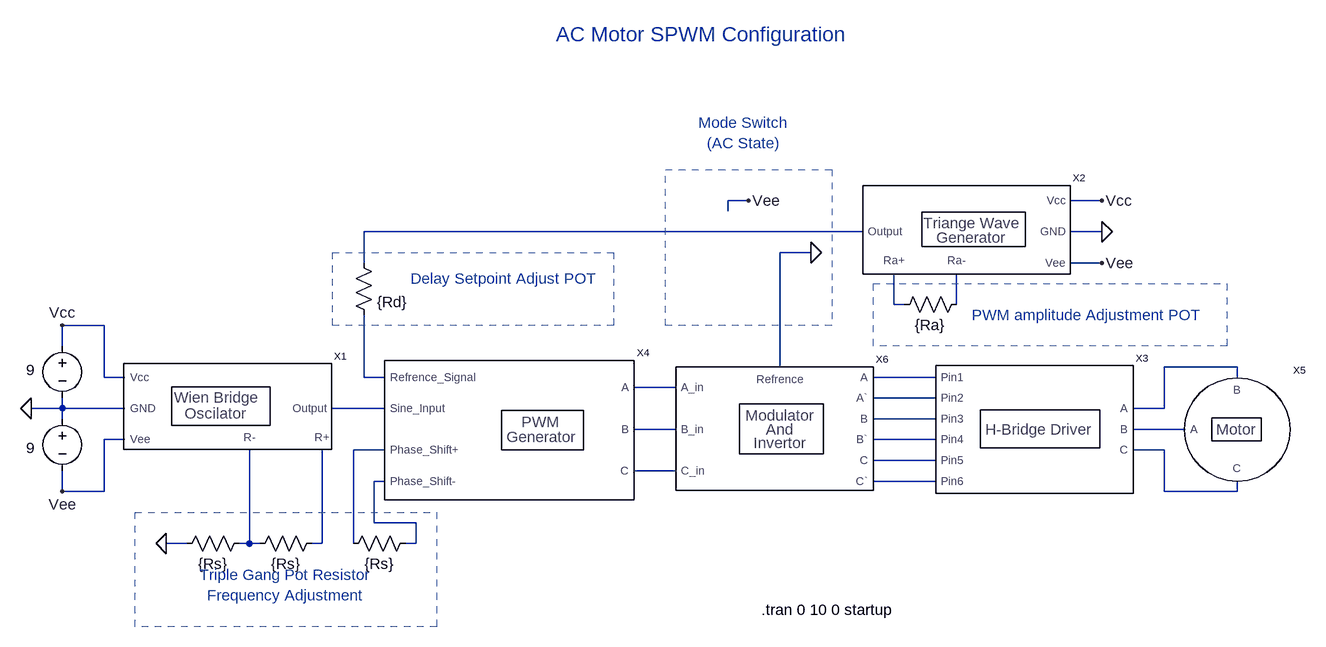
[diagram p0: schematic Complete_Design_Block_Diagram(AC).asc]
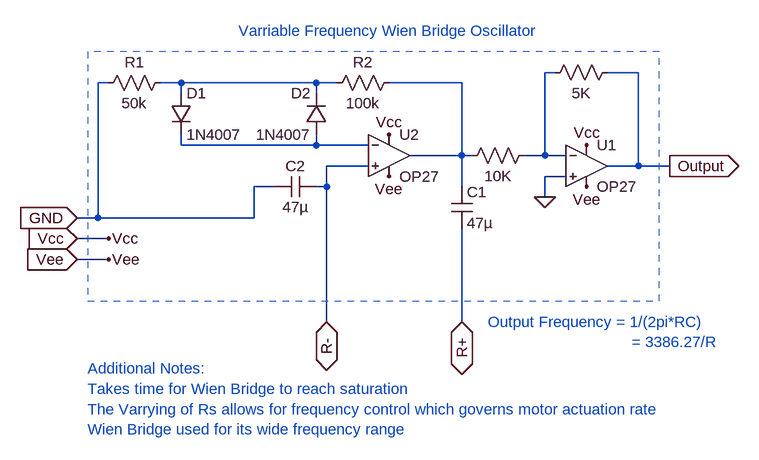
[diagram p1: sub-circuit wien_bridge_oscilator.asc]
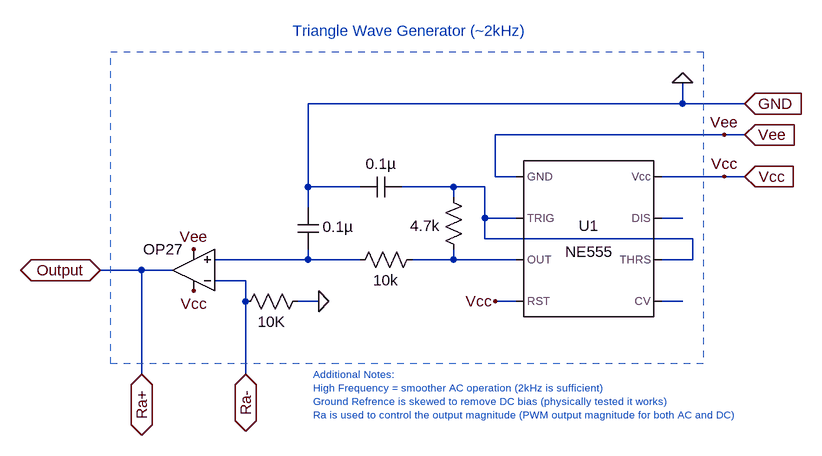
[diagram p2: sub-circuit triangle_wave_generator.asc]
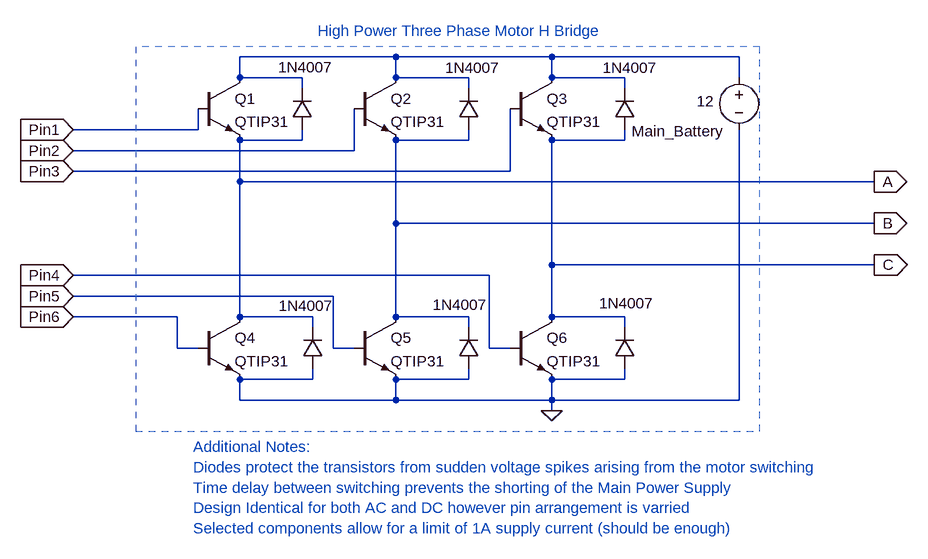
[diagram p3: sub-circuit h_bridge_driver.asc]
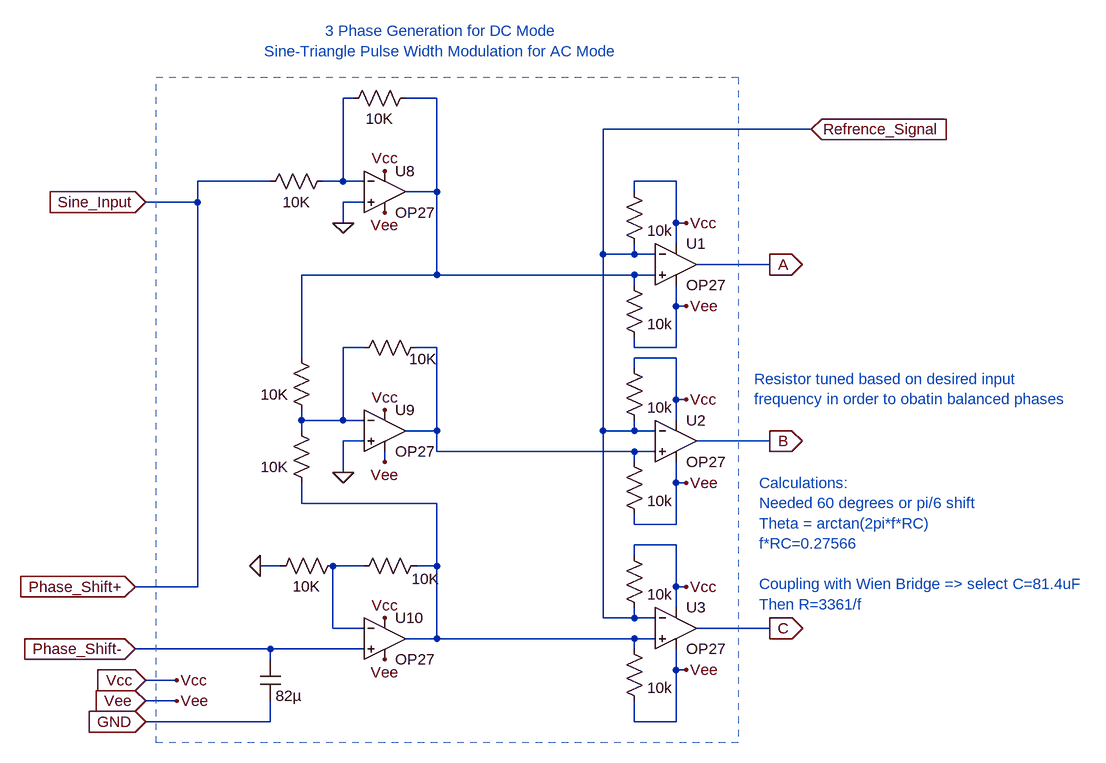
[diagram p4: sub-circuit pwm_generator.asc]
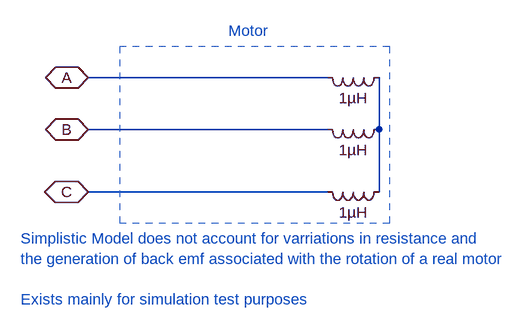
[diagram p5: sub-circuit simple_motor.asc]
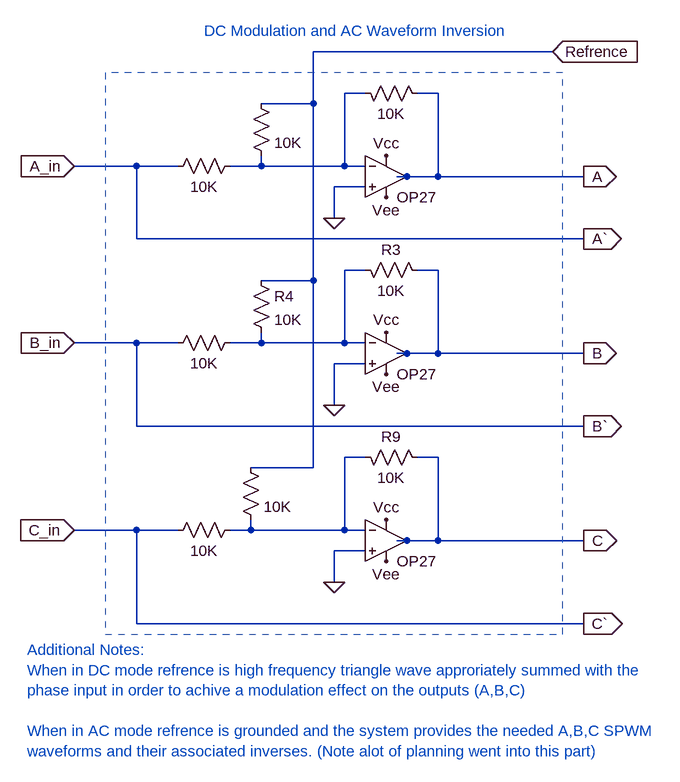
[diagram p6: sub-circuit modulation_and_inversion.asc]
Complete_Design_Block_Diagram(AC).asc, the LTspice schematic file:
Version 4
SHEET 1 1172 800
WIRE 336 32 304 32
WIRE 880 32 832 32
WIRE 304 48 304 32
WIRE 512 80 -256 80
WIRE 880 80 832 80
WIRE 432 112 384 112
WIRE -256 128 -256 80
WIRE 880 128 832 128
WIRE 560 192 560 144
WIRE 576 192 560 192
WIRE 656 192 656 144
WIRE -656 224 -720 224
WIRE -720 256 -720 224
WIRE 384 288 384 112
WIRE 1088 288 976 288
WIRE -656 304 -656 224
WIRE -624 304 -656 304
WIRE -256 304 -256 208
WIRE -224 304 -256 304
WIRE 624 304 528 304
WIRE 1088 304 1088 288
WIRE 224 320 160 320
WIRE 624 336 528 336
WIRE -720 352 -720 336
WIRE -720 352 -768 352
WIRE -624 352 -720 352
WIRE -224 352 -304 352
WIRE 976 352 976 288
WIRE 976 352 928 352
WIRE -720 368 -720 352
WIRE 624 368 528 368
WIRE 224 384 160 384
WIRE 1008 384 928 384
WIRE -624 400 -656 400
WIRE 624 400 528 400
WIRE -224 416 -272 416
WIRE 976 416 928 416
WIRE 624 432 528 432
WIRE 224 448 160 448
WIRE -224 464 -240 464
WIRE 624 464 528 464
WIRE -720 480 -720 448
WIRE -656 480 -656 400
WIRE -656 480 -720 480
WIRE 976 480 976 416
WIRE 1088 480 1088 464
WIRE 1088 480 976 480
WIRE -240 528 -240 464
WIRE -176 528 -240 528
WIRE -528 560 -560 560
WIRE -432 560 -432 416
WIRE -432 560 -448 560
WIRE -416 560 -432 560
WIRE -320 560 -320 416
WIRE -320 560 -336 560
WIRE -272 560 -272 416
WIRE -176 560 -176 528
WIRE -176 560 -192 560
FLAG -768 352 0
FLAG -720 224 Vcc
FLAG -720 480 Vee
FLAG 880 32 Vcc
FLAG 880 128 Vee
FLAG 880 80 0
FLAG -560 560 0
FLAG 432 112 0
FLAG 336 32 Vee
SYMBOL Wien_Bridge_Oscilator -480 352 R0
SYMATTR InstName X1
SYMBOL Triangle_Wave_Generator 672 80 R0
SYMATTR InstName X2
SYMBOL H_Bridge_Driver 784 384 R0
SYMATTR InstName X3
SYMBOL PWM_Generator 0 384 R0
SYMATTR InstName X4
SYMBOL Simple_Motor 1088 384 R0
SYMATTR InstName X5
SYMBOL Modulation_and_Inversion 384 384 R0
SYMATTR InstName X6
SYMBOL voltage -720 240 R0
WINDOW 0 24 16 Invisible 2
WINDOW 3 -42 53 Right 2
WINDOW 123 0 0 Left 2
WINDOW 39 0 0 Left 2
SYMATTR InstName V1
SYMATTR Value 9
SYMBOL voltage -720 352 R0
WINDOW 0 24 16 Invisible 2
WINDOW 3 -42 61 Right 2
WINDOW 123 0 0 Left 2
WINDOW 39 0 0 Left 2
SYMATTR InstName V2
SYMATTR Value 9
SYMBOL res 672 176 R90
WINDOW 0 0 56 Invisible 2
WINDOW 3 32 56 VTop 2
SYMATTR InstName R1
SYMATTR Value {Ra}
SYMBOL res -320 544 R90
WINDOW 0 0 56 Invisible 2
WINDOW 3 32 56 VTop 2
SYMATTR InstName R2
SYMATTR Value {Rs}
SYMBOL res -432 544 R90
WINDOW 0 0 56 Invisible 2
WINDOW 3 32 56 VTop 2
SYMATTR InstName R3
SYMATTR Value {Rs}
SYMBOL res -176 544 R90
WINDOW 0 0 56 Invisible 2
WINDOW 3 32 56 VTop 2
SYMATTR InstName R4
SYMATTR Value {Rs}
SYMBOL res -272 112 R0
WINDOW 0 36 40 Invisible 2
SYMATTR InstName R5
SYMATTR Value {Rd}
TEXT -376 624 Center 2 ;Triple Gang Pot Resistor\nFrequency Adjustment
TEXT -184 152 Left 2 ;Delay Setpoint Adjust POT
TEXT 680 208 Left 2 ;PWM amplitude Adjustment POT
TEXT 328 -72 Center 2 ;Mode Switch\n(AC State)
TEXT 40 -224 Left 3 ;AC Motor SPWM Configuration
TEXT 356 662 Left 2 !.tran 0 10 0 startup
RECTANGLE Normal -144 688 -608 512 2
RECTANGLE Normal 128 224 -304 112 2
RECTANGLE Normal 1072 256 528 160 2
RECTANGLE Normal 464 224 208 -16 2

wien_bridge_oscilator.asc, the sub-circuit schematic file:
Version 4
SHEET 1 1460 680
WIRE 480 -32 464 -32
WIRE 608 -32 560 -32
WIRE -208 -16 -224 -16
WIRE -96 -16 -128 -16
WIRE 112 -16 -96 -16
WIRE 144 -16 112 -16
WIRE 336 -16 224 -16
WIRE -96 0 -96 -16
WIRE 112 0 112 -16
WIRE -96 80 -96 64
WIRE 112 80 112 64
WIRE 112 80 -96 80
WIRE 192 80 112 80
WIRE 336 96 336 -16
WIRE 336 96 256 96
WIRE 352 96 336 96
WIRE 464 96 464 -32
WIRE 464 96 432 96
WIRE 496 96 464 96
WIRE 192 112 128 112
WIRE 608 112 608 -32
WIRE 608 112 560 112
WIRE 656 112 608 112
WIRE 496 128 464 128
WIRE 48 144 16 144
WIRE 128 144 128 112
WIRE 128 144 112 144
WIRE 336 144 336 96
WIRE 464 160 464 128
WIRE -224 192 -224 -16
WIRE -224 192 -256 192
WIRE 16 192 16 144
WIRE 16 192 -224 192
WIRE -208 224 -256 224
WIRE -208 256 -256 256
WIRE 128 352 128 144
WIRE 336 352 336 208
FLAG -256 256 Vee
IOPIN -256 256 In
FLAG 224 128 Vee
FLAG 224 64 Vcc
FLAG 656 112 Output
IOPIN 656 112 Out
FLAG -256 192 GND
IOPIN -256 192 In
FLAG -256 224 Vcc
IOPIN -256 224 In
FLAG -208 256 Vee
FLAG -208 224 Vcc
FLAG 128 352 R-
IOPIN 128 352 BiDir
FLAG 336 352 R+
IOPIN 336 352 BiDir
FLAG 464 160 0
FLAG 528 80 Vcc
FLAG 528 144 Vee
SYMBOL Opamps\\OP27 224 32 R0
SYMATTR InstName U2
SYMBOL res -224 0 R270
WINDOW 0 32 56 VTop 2
WINDOW 3 0 56 VBottom 2
SYMATTR InstName R1
SYMATTR Value 50k
SYMBOL res 128 0 R270
WINDOW 0 32 56 VTop 2
WINDOW 3 0 56 VBottom 2
SYMATTR InstName R2
SYMATTR Value 100k
SYMBOL cap 320 144 R0
SYMATTR InstName C1
SYMATTR Value 47µ
SYMBOL cap 112 128 R90
WINDOW 0 0 32 VBottom 2
WINDOW 3 32 32 VTop 2
SYMATTR InstName C2
SYMATTR Value 47µ
SYMBOL diode -112 0 R0
SYMATTR InstName D1
SYMATTR Value 1N4007
SYMBOL diode 128 64 R180
WINDOW 0 24 64 Left 2
WINDOW 3 24 0 Left 2
SYMATTR InstName D2
SYMATTR Value 1N4007
SYMBOL Opamps\\OP27 528 48 R0
SYMATTR InstName U1
SYMBOL res 448 80 R90
WINDOW 0 0 56 Invisible 2
WINDOW 3 32 56 VTop 2
SYMATTR InstName R3
SYMATTR Value 10K
SYMBOL res 576 -48 R90
WINDOW 0 0 56 Invisible 2
WINDOW 3 32 56 VTop 2
SYMATTR InstName R4
SYMATTR Value 5K
TEXT -8 -96 Left 2 ;Varriable Frequency Wien Bridge Oscillator
TEXT -240 424 Left 2 ;Additional Notes:\nTakes time for Wien Bridge to reach saturation\nThe Varrying of Rs allows for frequency control which governs motor actuation rate\nWien Bridge used for its wide frequency range
TEXT 376 352 Left 2 ;Output Frequency = 1/(2pi*RC)\n                                = 3386.27/R
RECTANGLE Normal -240 320 640 -64 2

triangle_wave_generator.asc, the sub-circuit schematic file:
Version 4
SHEET 1 880 680
WIRE 192 -112 192 -144
WIRE 192 -112 -384 -112
WIRE 288 -112 192 -112
WIRE 256 -64 -96 -64
WIRE 288 -64 256 -64
WIRE -96 0 -96 -64
WIRE -64 0 -96 0
WIRE 256 0 160 0
WIRE 288 0 256 0
WIRE -384 16 -384 -112
WIRE -304 16 -384 16
WIRE -160 16 -240 16
WIRE -112 16 -160 16
WIRE -160 32 -160 16
WIRE -384 48 -384 16
WIRE -112 64 -112 16
WIRE -64 64 -112 64
WIRE 192 64 160 64
WIRE -112 96 -112 64
WIRE 208 96 -112 96
WIRE -384 128 -384 112
WIRE -384 128 -528 128
WIRE -304 128 -384 128
WIRE -160 128 -160 112
WIRE -160 128 -224 128
WIRE -64 128 -160 128
WIRE 208 128 208 96
WIRE 208 128 160 128
WIRE -640 144 -704 144
WIRE -592 144 -640 144
WIRE -480 160 -528 160
WIRE -480 192 -480 160
WIRE -368 192 -400 192
WIRE -64 192 -96 192
WIRE 192 192 160 192
WIRE -640 304 -640 144
WIRE -480 304 -480 192
FLAG 288 0 Vcc
IOPIN 288 0 In
FLAG -704 144 Output
IOPIN -704 144 BiDir
FLAG 288 -64 Vee
IOPIN 288 -64 In
FLAG 288 -112 GND
IOPIN 288 -112 In
FLAG 192 -144 0
FLAG 256 -64 Vee
FLAG 256 0 Vcc
FLAG -96 192 Vcc
FLAG -560 176 Vcc
FLAG -368 192 0
FLAG -560 112 Vee
FLAG -640 304 Ra+
IOPIN -640 304 BiDir
FLAG -480 304 Ra-
IOPIN -480 304 BiDir
SYMBOL Misc\\NE555 48 96 R0
SYMATTR InstName U1
SYMBOL res -208 112 R90
WINDOW 0 0 56 Invisible 2
WINDOW 3 32 56 VTop 2
SYMATTR InstName R3
SYMATTR Value 10k
SYMBOL cap -368 112 R180
WINDOW 0 24 56 Invisible 2
WINDOW 3 -54 35 Left 2
SYMATTR InstName C2
SYMATTR Value 0.1µ
SYMBOL res -144 128 R180
WINDOW 0 36 76 Invisible 2
WINDOW 3 37 52 Left 2
SYMATTR InstName R1
SYMATTR Value 4.7k
SYMBOL cap -304 32 R270
WINDOW 0 32 32 Invisible 2
WINDOW 3 67 32 VBottom 2
SYMATTR InstName C1
SYMATTR Value 0.1µ
SYMBOL Opamps\\OP27 -560 208 R180
WINDOW 0 16 32 Invisible 2
SYMATTR InstName U5
SYMBOL res -496 208 R270
WINDOW 0 32 56 Invisible 2
WINDOW 3 0 56 VBottom 2
SYMATTR InstName R10
SYMATTR Value 10K
TEXT -376 304 Left 1 ;Additional Notes:\nHigh Frequency = smoother AC operation (2kHz is sufficient)\nGround Refrence is skewed to remove DC bias (physically tested it works)\nRa is used to control the output magnitude (PWM output magnitude for both AC and DC)
TEXT -408 -224 Left 2 ;Triangle Wave Generator (~2kHz)
RECTANGLE Normal 224 288 -688 -192 2

h_bridge_driver.asc, the sub-circuit schematic file:
Version 4
SHEET 1 880 680
WIRE -80 -288 -320 -288
WIRE 160 -288 -80 -288
WIRE 448 -288 160 -288
WIRE -320 -256 -320 -288
WIRE -224 -256 -320 -256
WIRE -80 -256 -80 -288
WIRE 32 -256 -80 -256
WIRE 160 -256 160 -288
WIRE 272 -256 160 -256
WIRE 448 -256 448 -288
WIRE -224 -240 -224 -256
WIRE 32 -240 32 -256
WIRE 272 -240 272 -256
WIRE -384 -176 -384 -208
WIRE -384 -176 -576 -176
WIRE -224 -160 -224 -176
WIRE -224 -160 -320 -160
WIRE 32 -160 32 -176
WIRE 32 -160 -80 -160
WIRE 272 -160 272 -176
WIRE 272 -160 160 -160
WIRE -144 -144 -144 -208
WIRE -144 -144 -576 -144
WIRE 96 -112 96 -208
WIRE 96 -112 -576 -112
WIRE -320 -96 -320 -160
WIRE 656 -96 -320 -96
WIRE -80 -32 -80 -160
WIRE 656 -32 -80 -32
WIRE 160 32 160 -160
WIRE 656 32 160 32
WIRE 64 48 -576 48
WIRE -176 80 -576 80
WIRE -416 112 -576 112
WIRE -320 112 -320 -96
WIRE -208 112 -320 112
WIRE -80 112 -80 -32
WIRE 32 112 -80 112
WIRE 160 112 160 32
WIRE 272 112 160 112
WIRE -208 128 -208 112
WIRE 32 128 32 112
WIRE 272 128 272 112
WIRE -416 160 -416 112
WIRE -384 160 -416 160
WIRE -176 160 -176 80
WIRE -144 160 -176 160
WIRE 64 160 64 48
WIRE 96 160 64 160
WIRE -208 208 -208 192
WIRE -208 208 -320 208
WIRE 32 208 32 192
WIRE 32 208 -80 208
WIRE 272 208 272 192
WIRE 272 208 160 208
WIRE -320 240 -320 208
WIRE -80 240 -80 208
WIRE -80 240 -320 240
WIRE 160 240 160 208
WIRE 160 240 -80 240
WIRE 448 240 448 -176
WIRE 448 240 160 240
WIRE 160 256 160 240
FLAG 160 256 0
FLAG -576 -176 Pin1
IOPIN -576 -176 In
FLAG -576 -144 Pin2
IOPIN -576 -144 In
FLAG -576 -112 Pin3
IOPIN -576 -112 In
FLAG -576 48 Pin4
IOPIN -576 48 In
FLAG -576 80 Pin5
IOPIN -576 80 In
FLAG -576 112 Pin6
IOPIN -576 112 In
FLAG 656 -96 A
IOPIN 656 -96 Out
FLAG 656 -32 B
IOPIN 656 -32 Out
FLAG 656 32 C
IOPIN 656 32 Out
SYMBOL voltage 448 -272 M0
WINDOW 123 0 0 Left 2
WINDOW 39 0 0 Left 2
WINDOW 0 165 98 Right 2
WINDOW 3 65 52 Right 2
SYMATTR InstName Main_Battery
SYMATTR Value 12
SYMBOL diode -240 -176 M180
WINDOW 0 24 64 Invisible 2
WINDOW 3 -21 96 Left 2
SYMATTR InstName D1
SYMATTR Value 1N4007
SYMBOL diode 16 -176 M180
WINDOW 0 24 64 Invisible 2
WINDOW 3 -20 95 Left 2
SYMATTR InstName D2
SYMATTR Value 1N4007
SYMBOL diode 256 -176 M180
WINDOW 0 24 64 Invisible 2
WINDOW 3 -18 95 Left 2
SYMATTR InstName D3
SYMATTR Value 1N4007
SYMBOL diode 256 192 M180
WINDOW 0 24 64 Invisible 2
WINDOW 3 -23 101 Left 2
SYMATTR InstName D4
SYMATTR Value 1N4007
SYMBOL diode 16 192 M180
WINDOW 0 24 64 Invisible 2
WINDOW 3 -39 99 Left 2
SYMATTR InstName D5
SYMATTR Value 1N4007
SYMBOL diode -224 192 M180
WINDOW 0 24 64 Invisible 2
WINDOW 3 -36 97 Left 2
SYMATTR InstName D6
SYMATTR Value 1N4007
SYMBOL npn -384 -256 R0
SYMATTR InstName Q1
SYMATTR Value QTIP31
SYMBOL npn -144 -256 R0
SYMATTR InstName Q2
SYMATTR Value QTIP31
SYMBOL npn 96 -256 R0
SYMATTR InstName Q3
SYMATTR Value QTIP31
SYMBOL npn -384 112 R0
SYMATTR InstName Q4
SYMATTR Value QTIP31
SYMBOL npn -144 112 R0
SYMATTR InstName Q5
SYMATTR Value QTIP31
SYMBOL npn 96 112 R0
SYMATTR InstName Q6
SYMATTR Value QTIP31
TEXT -200 -328 Left 2 ;High Power Three Phase Motor H Bridge
TEXT -392 312 Left 2 ;Additional Notes:\nDiodes protect the transistors from sudden voltage spikes arising from the motor switching\nTime delay between switching prevents the shorting of the Main Power Supply\nDesign Identical for both AC and DC however pin arrangement is varried\nSelected components allow for a limit of 1A supply current (should be enough)
RECTANGLE Normal -480 288 480 -304 2

pwm_generator.asc, the sub-circuit schematic file:
Version 4
SHEET 1 2652 680
WIRE -224 -656 -240 -656
WIRE -96 -656 -144 -656
WIRE 480 -608 160 -608
WIRE -352 -528 -464 -528
WIRE -240 -528 -240 -656
WIRE -240 -528 -272 -528
WIRE -208 -528 -240 -528
WIRE 272 -528 208 -528
WIRE -96 -512 -96 -656
WIRE -96 -512 -144 -512
WIRE 208 -512 208 -528
WIRE -464 -496 -464 -528
WIRE -464 -496 -544 -496
WIRE -208 -496 -240 -496
WIRE -240 -464 -240 -496
WIRE 272 -464 272 -528
WIRE 288 -464 272 -464
WIRE 272 -432 272 -464
WIRE 160 -416 160 -608
WIRE 208 -416 208 -432
WIRE 208 -416 160 -416
WIRE 240 -416 208 -416
WIRE 416 -400 304 -400
WIRE -96 -384 -96 -512
WIRE -96 -384 -304 -384
WIRE 208 -384 -96 -384
WIRE 240 -384 208 -384
WIRE 208 -368 208 -384
WIRE 272 -336 272 -368
WIRE 288 -336 272 -336
WIRE -208 -272 -240 -272
WIRE -96 -272 -128 -272
WIRE 208 -272 208 -288
WIRE 272 -272 272 -336
WIRE 272 -272 208 -272
WIRE -304 -256 -304 -384
WIRE 272 -256 208 -256
WIRE 208 -240 208 -256
WIRE 272 -192 272 -256
WIRE 288 -192 272 -192
WIRE -304 -160 -304 -176
WIRE -240 -160 -240 -272
WIRE -240 -160 -304 -160
WIRE -208 -160 -240 -160
WIRE 272 -160 272 -192
WIRE -304 -144 -304 -160
WIRE -96 -144 -96 -272
WIRE -96 -144 -144 -144
WIRE 160 -144 160 -416
WIRE 208 -144 208 -160
WIRE 208 -144 160 -144
WIRE 240 -144 208 -144
WIRE -208 -128 -240 -128
WIRE 416 -128 304 -128
WIRE -96 -112 -96 -144
WIRE 208 -112 -96 -112
WIRE 240 -112 208 -112
WIRE -176 -96 -176 -112
WIRE 208 -96 208 -112
WIRE -240 -80 -240 -128
WIRE 272 -64 272 -96
WIRE 288 -64 272 -64
WIRE -304 -32 -304 -64
WIRE -96 -32 -304 -32
WIRE 208 0 208 -16
WIRE 272 0 272 -64
WIRE 272 0 208 0
WIRE 272 32 208 32
WIRE 208 48 208 32
WIRE -336 64 -368 64
WIRE -208 64 -256 64
WIRE -96 64 -96 -32
WIRE -96 64 -128 64
WIRE -464 96 -464 -496
WIRE -464 96 -560 96
WIRE 272 96 272 32
WIRE 288 96 272 96
WIRE 272 128 272 96
WIRE 160 144 160 -144
WIRE 208 144 208 128
WIRE 208 144 160 144
WIRE 240 144 208 144
WIRE -256 160 -256 64
WIRE -208 160 -256 160
WIRE 416 160 304 160
WIRE -96 176 -96 64
WIRE -96 176 -144 176
WIRE 208 176 -96 176
WIRE 240 176 208 176
WIRE -352 192 -560 192
WIRE -208 192 -352 192
WIRE 208 192 208 176
WIRE -352 208 -352 192
WIRE 272 224 272 192
WIRE 288 224 272 224
WIRE -496 240 -544 240
WIRE -496 272 -544 272
WIRE -352 304 -352 272
WIRE -352 304 -544 304
WIRE 208 304 208 272
WIRE 272 304 272 224
WIRE 272 304 208 304
FLAG -240 -464 0
FLAG -176 -544 Vcc
FLAG -176 -176 Vcc
FLAG -176 144 Vcc
FLAG -368 64 0
FLAG -176 -96 Vee
FLAG -176 208 Vee
FLAG -240 -80 0
FLAG 288 -464 Vcc
FLAG 288 -192 Vcc
FLAG 288 96 Vcc
FLAG 416 -400 A
IOPIN 416 -400 Out
FLAG 416 -128 B
IOPIN 416 -128 Out
FLAG 416 160 C
IOPIN 416 160 Out
FLAG -544 -496 Sine_Input
IOPIN -544 -496 In
FLAG -560 96 Phase_Shift+
IOPIN -560 96 In
FLAG -560 192 Phase_Shift-
IOPIN -560 192 In
FLAG 480 -608 Refrence_Signal
IOPIN 480 -608 In
FLAG -544 272 Vee
IOPIN -544 272 In
FLAG -544 304 GND
IOPIN -544 304 In
FLAG -544 240 Vcc
IOPIN -544 240 In
FLAG -496 272 Vee
FLAG -496 240 Vcc
FLAG -176 -480 Vee
FLAG 288 -64 Vee
FLAG 288 -336 Vee
FLAG 288 224 Vee
SYMBOL Opamps\\OP27 -176 -576 R0
SYMATTR InstName U8
SYMBOL Opamps\\OP27 -176 -208 R0
SYMATTR InstName U9
SYMBOL Opamps\\OP27 -176 112 R0
SYMATTR InstName U10
SYMBOL res -256 -544 R90
WINDOW 0 0 56 Invisible 2
WINDOW 3 32 56 VTop 2
SYMATTR InstName R22
SYMATTR Value 10K
SYMBOL res -128 -672 R90
WINDOW 0 0 56 Invisible 2
WINDOW 3 32 56 VTop 2
SYMATTR InstName R23
SYMATTR Value 10K
SYMBOL res -112 -288 R90
WINDOW 0 0 56 Invisible 2
WINDOW 3 18 5 VTop 2
SYMATTR InstName R26
SYMATTR Value 10K
SYMBOL res -112 48 R90
WINDOW 0 0 56 Invisible 2
WINDOW 3 20 1 VTop 2
SYMATTR InstName R28
SYMATTR Value 10K
SYMBOL res -240 48 R90
WINDOW 0 0 56 Invisible 2
WINDOW 3 32 56 VTop 2
SYMATTR InstName R29
SYMATTR Value 10K
SYMBOL Opamps\\OP27 272 -464 R0
SYMATTR InstName U1
SYMBOL res 192 -528 R0
WINDOW 0 36 40 Invisible 2
SYMATTR InstName R1
SYMATTR Value 10k
SYMBOL res 192 -384 R0
WINDOW 0 36 40 Invisible 2
SYMATTR InstName R2
SYMATTR Value 10k
SYMBOL Opamps\\OP27 272 -192 R0
SYMATTR InstName U2
SYMBOL res 192 -256 R0
WINDOW 0 36 40 Invisible 2
SYMATTR InstName R3
SYMATTR Value 10k
SYMBOL res 192 -112 R0
WINDOW 0 36 40 Invisible 2
SYMATTR InstName R4
SYMATTR Value 10k
SYMBOL Opamps\\OP27 272 96 R0
SYMATTR InstName U3
SYMBOL res 192 32 R0
WINDOW 0 36 40 Invisible 2
SYMATTR InstName R5
SYMATTR Value 10k
SYMBOL res 192 176 R0
WINDOW 0 36 40 Invisible 2
SYMATTR InstName R6
SYMATTR Value 10k
SYMBOL res -288 -160 R180
WINDOW 0 36 76 Invisible 2
WINDOW 3 36 40 Left 2
SYMATTR InstName R7
SYMATTR Value 10K
SYMBOL res -288 -48 R180
WINDOW 0 36 76 Invisible 2
WINDOW 3 36 40 Left 2
SYMATTR InstName R10
SYMATTR Value 10K
SYMBOL cap -368 208 R0
WINDOW 0 24 8 Invisible 2
SYMATTR InstName C2
SYMATTR Value 82µ
TEXT 392 -224 Left 2 ;Resistor tuned based on desired input\nfrequency in order to obatin balanced phases
TEXT -88 -744 Center 2 ;3 Phase Generation for DC Mode\nSine-Triangle Pulse Width Modulation for AC Mode
TEXT 400 -64 Left 2 ;Calculations:\nNeeded 60 degrees or pi/6 shift\nTheta = arctan(2pi*f*RC)\nf*RC=0.27566\n \nCoupling with Wien Bridge => select C=81.4uF\nThen R=3361/f
RECTANGLE Normal 368 336 -528 -688 2

simple_motor.asc, the sub-circuit schematic file:
Version 4
SHEET 1 880 680
WIRE 272 -48 -96 -48
WIRE 272 32 -96 32
WIRE 352 32 352 -48
WIRE 272 128 -96 128
WIRE 352 128 352 32
FLAG -96 -48 A
IOPIN -96 -48 BiDir
FLAG -96 32 B
IOPIN -96 32 BiDir
FLAG -96 128 C
IOPIN -96 128 BiDir
SYMBOL ind 368 -64 R90
WINDOW 0 5 56 Invisible 2
WINDOW 3 32 56 VTop 2
SYMATTR InstName L1
SYMATTR Value 1µH
SYMATTR SpiceLine Ipk=0.8 Rser=0.01
SYMBOL ind 368 16 R90
WINDOW 0 5 56 Invisible 2
WINDOW 3 32 56 VTop 2
SYMATTR InstName L2
SYMATTR Value 1µH
SYMATTR SpiceLine Ipk=0.8 Rser=0.01
SYMBOL ind 368 112 R90
WINDOW 0 5 56 Invisible 2
WINDOW 3 32 56 VTop 2
SYMATTR InstName L3
SYMATTR Value 1µH
SYMATTR SpiceLine Ipk=0.8 Rser=0.01
TEXT 120 -120 Left 2 ;Motor
TEXT -200 200 Left 2 ;Simplistic Model does not account for varriations in resistance and \nthe generation of back emf associated with the rotation of a real motor\n \nExists mainly for simulation test purposes
RECTANGLE Normal 368 -96 -48 176 2

modulation_and_inversion.asc, the sub-circuit schematic file:
Version 4
SHEET 1 880 1116
WIRE 240 16 -128 16
WIRE -48 80 -80 80
WIRE 64 80 32 80
WIRE -128 96 -128 16
WIRE -128 96 -208 96
WIRE -400 192 -496 192
WIRE -336 192 -400 192
WIRE -208 192 -208 176
WIRE -208 192 -256 192
WIRE -80 192 -80 80
WIRE -80 192 -208 192
WIRE -48 192 -80 192
WIRE 16 208 0 208
WIRE 64 208 64 80
WIRE 64 208 16 208
WIRE 288 208 64 208
WIRE -48 224 -96 224
WIRE -96 272 -96 224
WIRE -400 304 -400 192
WIRE 288 304 -400 304
WIRE -48 352 -80 352
WIRE 64 352 32 352
WIRE -128 368 -128 96
WIRE -128 368 -208 368
WIRE -400 464 -496 464
WIRE -336 464 -400 464
WIRE -208 464 -208 448
WIRE -208 464 -256 464
WIRE -80 464 -80 352
WIRE -80 464 -208 464
WIRE -48 464 -80 464
WIRE 16 480 0 480
WIRE 64 480 64 352
WIRE 64 480 16 480
WIRE 288 480 64 480
WIRE -48 496 -96 496
WIRE -96 560 -96 496
WIRE -400 592 -400 464
WIRE 288 592 -400 592
WIRE -48 640 -80 640
WIRE 64 640 32 640
WIRE -128 656 -128 368
WIRE -128 656 -224 656
WIRE -400 752 -496 752
WIRE -336 752 -400 752
WIRE -224 752 -224 736
WIRE -224 752 -256 752
WIRE -80 752 -80 640
WIRE -80 752 -224 752
WIRE -48 752 -80 752
WIRE 16 768 0 768
WIRE 64 768 64 640
WIRE 64 768 16 768
WIRE 288 768 64 768
WIRE -48 784 -96 784
WIRE -96 832 -96 784
WIRE -400 896 -400 752
WIRE 288 896 -400 896
FLAG -16 448 Vcc
FLAG -16 512 Vee
FLAG -96 560 0
FLAG -16 176 Vcc
FLAG -16 240 Vee
FLAG -96 272 0
FLAG -16 736 Vcc
FLAG -16 800 Vee
FLAG -96 832 0
FLAG 288 208 A
IOPIN 288 208 Out
FLAG 288 304 A`
IOPIN 288 304 Out
FLAG 288 480 B
IOPIN 288 480 Out
FLAG 288 592 B`
IOPIN 288 592 Out
FLAG 288 768 C
IOPIN 288 768 Out
FLAG 288 896 C`
IOPIN 288 896 Out
FLAG -496 192 A_in
IOPIN -496 192 In
FLAG -496 464 B_in
IOPIN -496 464 In
FLAG -496 752 C_in
IOPIN -496 752 In
FLAG 240 16 Refrence
IOPIN 240 16 In
SYMBOL res -352 768 R270
WINDOW 0 32 56 Invisible 2
WINDOW 3 0 56 VBottom 2
SYMATTR InstName R1
SYMATTR Value 10K
SYMBOL res -240 640 R0
WINDOW 0 36 40 Invisible 2
SYMATTR InstName R2
SYMATTR Value 10K
SYMBOL res 48 368 M270
WINDOW 0 32 56 VTop 2
WINDOW 3 0 56 VBottom 2
SYMATTR InstName R3
SYMATTR Value 10K
SYMBOL res -224 352 R0
SYMATTR InstName R4
SYMATTR Value 10K
SYMBOL Opamps\\OP27 -16 416 R0
WINDOW 0 16 32 Invisible 2
SYMATTR InstName U1
SYMBOL res -240 448 R90
WINDOW 0 0 56 Invisible 2
WINDOW 3 32 56 VTop 2
SYMATTR InstName R5
SYMATTR Value 10K
SYMBOL res 48 96 M270
WINDOW 0 32 56 Invisible 2
WINDOW 3 0 56 VBottom 2
SYMATTR InstName R6
SYMATTR Value 10K
SYMBOL res -224 80 R0
WINDOW 0 36 40 Invisible 2
SYMATTR InstName R7
SYMATTR Value 10K
SYMBOL Opamps\\OP27 -16 144 R0
WINDOW 0 16 32 Invisible 2
SYMATTR InstName U2
SYMBOL res -240 176 R90
WINDOW 0 0 56 Invisible 2
WINDOW 3 32 56 VTop 2
SYMATTR InstName R8
SYMATTR Value 10K
SYMBOL res 48 656 M270
WINDOW 0 32 56 VTop 2
WINDOW 3 0 56 VBottom 2
SYMATTR InstName R9
SYMATTR Value 10K
SYMBOL Opamps\\OP27 -16 704 R0
WINDOW 0 16 32 Invisible 2
SYMATTR InstName U3
TEXT -296 -16 Left 2 ;DC Modulation and AC Waveform Inversion
TEXT -568 936 Left 2 ;Additional Notes:\nWhen in DC mode refrence is high frequency triangle wave approriately summed with the\nphase input in order to achive a modulation effect on the outputs (A,B,C)\n \nWhen in AC mode refrence is grounded and the system provides the needed A,B,C SPWM\nwaveforms and their associated inverses. (Note alot of planning went into this part)
RECTANGLE Normal -448 912 256 48 2

The netlist it stands for:
* Complete_Design_Block_Diagram(AC).asc
XX1 N009 0 Vee Vcc N020 N021 wien_bridge_oscilator
XX2 N001 Vcc 0 Vee N002 N003 triangle_wave_generator
XX3 N006 N008 N010 N013 N016 N019 N004 N012 N015 h_bridge_driver
XX4 N007 N011 N017 N005 N009 N014 N018 pwm_generator
XX5 N012 N004 N015 simple_motor
XX6 N007 N011 N017 N006 N008 N010 N016 N013 N019 0 modulation_and_inversion
V1 Vcc 0 9
V2 0 Vee 9
R1 N003 N002 {Ra}
R2 N021 N020 {Rs}
R3 N020 0 {Rs}
R4 N018 N014 {Rs}
R5 N001 N005 {Rd}

* block symbol definitions
.subckt wien_bridge_oscilator Output GND Vee Vcc R- R+
XU2 R- N004 Vcc Vee N003 OP27  ; pins In+ In- V+ V- OUT
R1 GND N002 50k
R2 N002 N003 100k
C1 N003 R+ 47µ
C2 R- GND 47µ
D1 N002 N004 1N4007
D2 N004 N002 1N4007
XU1 0 N001 Vcc Vee Output OP27  ; pins In+ In- V+ V- OUT
R3 N001 N003 10K
R4 Output N001 5K
* Varriable Frequency Wien Bridge Oscillator
* Additional Notes:
* Takes time for Wien Bridge to reach saturation
* The Varrying of Rs allows for frequency control which governs motor actuation rate
* Wien Bridge used for its wide frequency range
* Output Frequency = 1/(2pi*RC)
*                                 = 3386.27/R
.ends wien_bridge_oscilator

.subckt triangle_wave_generator Output Vcc GND Vee Ra+ Ra-
XU1 Vee N001 N004 Vcc N005 N001 N002 Vcc NE555  ; pins GND TRIG OUT RST CV THRS DIS Vcc
R3 N004 N003 10k
C2 N003 0 0.1µ
R1 N004 N001 4.7k
C1 0 N001 0.1µ
XU5 N003 Ra- Vcc Vee Output OP27  ; pins In+ In- V+ V- OUT
R10 Ra- 0 10K
* Additional Notes:
* High Frequency = smoother AC operation (2kHz is sufficient)
* Ground Refrence is skewed to remove DC bias (physically tested it works)
* Ra is used to control the output magnitude (PWM output magnitude for both AC and DC)
* Triangle Wave Generator (~2kHz)
.ends triangle_wave_generator

.subckt h_bridge_driver Pin1 Pin2 Pin3 Pin4 Pin5 Pin6 A B C
V§Main_Battery N001 0 12
D1 A N001 1N4007
D2 B N001 1N4007
D3 C N001 1N4007
D4 0 C 1N4007
D5 0 B 1N4007
D6 0 A 1N4007
Q1 N001 Pin1 A 0 QTIP31
Q2 N001 Pin2 B 0 QTIP31
Q3 N001 Pin3 C 0 QTIP31
Q4 A Pin6 0 0 QTIP31
Q5 B Pin5 0 0 QTIP31
Q6 C Pin4 0 0 QTIP31
* High Power Three Phase Motor H Bridge
* Additional Notes:
* Diodes protect the transistors from sudden voltage spikes arising from the motor switching
* Time delay between switching prevents the shorting of the Main Power Supply
* Design Identical for both AC and DC however pin arrangement is varried
* Selected components allow for a limit of 1A supply current (should be enough)
.ends h_bridge_driver

.subckt pwm_generator A B C Refrence_Signal Sine_Input Phase_Shift+ Phase_Shift-
XU8 0 N001 Vcc Vee N002 OP27  ; pins In+ In- V+ V- OUT
XU9 0 N003 Vcc Vee N004 OP27  ; pins In+ In- V+ V- OUT
XU10 Phase_Shift- N006 Vcc Vee N005 OP27  ; pins In+ In- V+ V- OUT
R22 N001 Sine_Input 10K
R23 N002 N001 10K
R26 N004 N003 10K
R28 N005 N006 10K
R29 N006 0 10K
XU1 N002 Refrence_Signal Vcc Vee A OP27  ; pins In+ In- V+ V- OUT
R1 Vcc Refrence_Signal 10k
R2 N002 Vee 10k
XU2 N004 Refrence_Signal Vcc Vee B OP27  ; pins In+ In- V+ V- OUT
R3 Vcc Refrence_Signal 10k
R4 N004 Vee 10k
XU3 N005 Refrence_Signal Vcc Vee C OP27  ; pins In+ In- V+ V- OUT
R5 Vcc Refrence_Signal 10k
R6 N005 Vee 10k
R7 N003 N002 10K
R10 N005 N003 10K
C2 Phase_Shift- GND 82µ
* Resistor tuned based on desired input
* frequency in order to obatin balanced phases
* 3 Phase Generation for DC Mode
* Sine-Triangle Pulse Width Modulation for AC Mode
* Calculations:
* Needed 60 degrees or pi/6 shift
* Theta = arctan(2pi*f*RC)
* f*RC=0.27566
* Coupling with Wien Bridge => select C=81.4uF
* Then R=3361/f
.ends pwm_generator

.subckt simple_motor A B C
L1 N001 A 1µH Ipk=0.8 Rser=0.01
L2 N001 B 1µH Ipk=0.8 Rser=0.01
L3 N001 C 1µH Ipk=0.8 Rser=0.01
* Motor
* Simplistic Model does not account for varriations in resistance and
* the generation of back emf associated with the rotation of a real motor
* Exists mainly for simulation test purposes
.ends simple_motor

.subckt modulation_and_inversion A_in B_in C_in A A` B C B` C` Refrence
R1 C` N003 10K
R2 Refrence N003 10K
R3 B N002 10K
R4 Refrence N002 10K
XU1 0 N002 Vcc Vee B OP27  ; pins In+ In- V+ V- OUT
R5 N002 B` 10K
R6 A N001 10K
R7 Refrence N001 10K
XU2 0 N001 Vcc Vee A OP27  ; pins In+ In- V+ V- OUT
R8 N001 A` 10K
R9 C N003 10K
XU3 0 N003 Vcc Vee C OP27  ; pins In+ In- V+ V- OUT
* DC Modulation and AC Waveform Inversion
* Additional Notes:
* When in DC mode refrence is high frequency triangle wave approriately summed with the
* phase input in order to achive a modulation effect on the outputs (A,B,C)
* When in AC mode refrence is grounded and the system provides the needed A,B,C SPWM
* waveforms and their associated inverses. (Note alot of planning went into this part)
.ends modulation_and_inversion

.model D D
.lib standard.dio
.model NPN NPN
.model PNP PNP
.lib standard.bjt
* Triple Gang Pot Resistor
* Frequency Adjustment
* Delay Setpoint Adjust POT
* PWM amplitude Adjustment POT
* Mode Switch
* (AC State)
* AC Motor SPWM Configuration
.tran 0 10 0 startup
.lib ADI.lib
.lib NE555.sub
.backanno
.end